# EAGLE schematic tyraka2.0 (EAGLE 9.6.1)
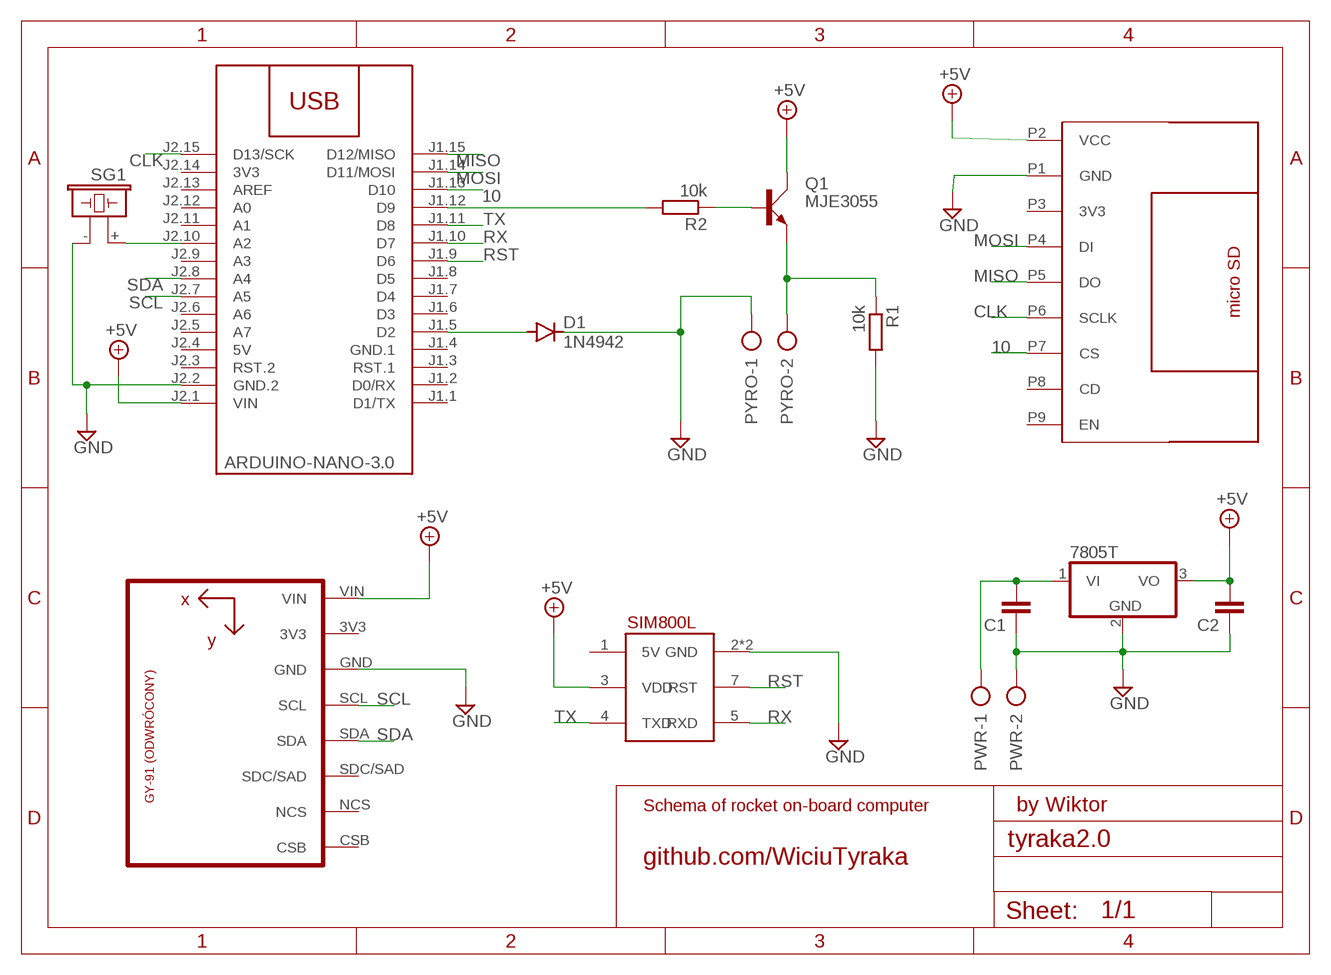
[diagram p0: schematic, sheet 1]

## Parts
C1  C2.5/4  [C2.5-4]
C2  C2.5/4  [C2.5-4]
D1  1N4942  [DO41-10]
IC2  7805T  [TO220H]
M1  ARDUINO-NANO-3.0  [ARDUINO-NANO-3.0]
PWR  AK500/2  [AK500/2]
PYRO  AK500/2  [AK500/2]
Q1  MJE3055  [TO220AV]
R1  10k  R-EU_0204/5  [0204/5]
R2  10k  R-EU_0204/5  [0204/5]
SD1  MICRO_SD  [MICRO_SD]
SG1  F/CM12P  [F/CM12P]
U1  GY-521MPU6050  [GY-521]
U$1  SIM800L  [SIP]

## Nets
10: M1.J1.13(D10) SD1.P7(CS)
+5V: C2.2 IC2.3(VO) M1.J2.1(VIN) Q1.C SD1.P2(VCC) U1.VIN U$1.3(VDD)
CLK: M1.J2.15(D13/SCK) SD1.P6(SCLK)
GND: C1.1 C2.1 D1.C IC2.2(GND) M1.J2.2(GND.2) PWR.2 PYRO.1 R1.2 SD1.P1(GND) SG1.- U1.GND U$1.2(GND) U$1.6(GND)
MISO: M1.J1.15(D12/MISO) SD1.P5(DO)
MOSI: M1.J1.14(D11/MOSI) SD1.P4(DI)
N$1: M1.J1.12(D9) R2.2
N$3: Q1.B R2.1
N$4: PYRO.2 Q1.E R1.1
N$5: D1.A M1.J1.5(D2)
N$6: M1.J2.10(A2) SG1.+
N$8: C1.2 IC2.1(VI) PWR.1
RST: M1.J1.9(D6) U$1.7(RST)
RX: M1.J1.10(D7) U$1.5(RXD)
SCL: M1.J2.7(A5) U1.SCL
SDA: M1.J2.8(A4) U1.SDA
TX: M1.J1.11(D8) U$1.4(TXD)
Unconnected: M1.J1.1(D1/TX) M1.J1.2(D0/RX) M1.J1.3(RST.1) M1.J1.6(D3) M1.J1.7(D4) M1.J1.8(D5) M1.J2.3(RST.2) M1.J2.5(A7) M1.J2.6(A6) M1.J2.9(A3) M1.J2.11(A1) M1.J2.12(A0) M1.J2.13(AREF) SD1.P3(3V3) SD1.P8(CD) SD1.P9(EN) U1.3V3 U1.CSB U1.NCS U1.SDC/SAD U$1.1(5V)

## Notes on the sheet
- Schema of rocket on-board computer | by Wiktor
- github.com/WiciuTyraka

## Power pins joined to a net without a drawn wire
3V3: M1.J2.14(3V3)
5V: M1.J2.4(5V)
GND.1: M1.J1.4(GND.1)

## Library data of the parts
C1 C2 = capacitor-wima:C: CAPACITOR naming: grid - package width
D1 = diode:1N4942: DIODE 1.0 A, 200 V, 150 ns
IC2 = linear:78*: Positive VOLTAGE REGULATOR Source: http://cache.national.com/ds/LM/LM78L05.pdf http://www.fairchildsemi.com/ds/LM/LM7805.pdf
M1 = ads1115:ARDUINO-NANO-3.0: Arduino Nano 3.0 and compatible devices More details available here: https://www.arduino.cc/en/Main/ArduinoBoardNano Click here to find device on ebay.com <http://www.ebay.com/sch/arduino+nano>
PWR PYRO = con-ptr500:AK500/2: CONNECTOR; OC_FARNELL: unknown; OC_NEWARK: unknown
Q1 = transistor-power:MJE3055: NPN TRANSISTOR
R1 R2 = rcl:R-EU_: RESISTOR, European symbol; SPICEPREFIX: R
SD1 = 111_microsd:MICRO_SD
SG1 = buzzer:F/CM12P: BUZZER Source: Buerklin; OC_FARNELL: unknown; OC_NEWARK: unknown
U1 = 111_BAROMETR:GY-521
U$1 = SIM800L:SIM800L: SIM800L Blue EVB Board with Level Translation and diode dropper.